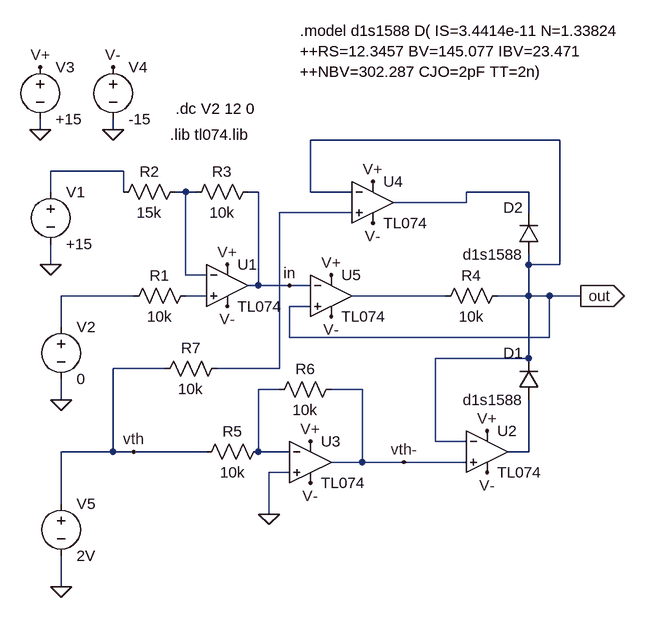
[diagram p0: schematic fig22down.asc]
fig22down.asc, the LTspice schematic file:
Version 4
SHEET 1 924 680
WIRE -80 -96 -80 -112
WIRE 32 -96 32 -112
WIRE 720 -80 336 -80
WIRE 48 -32 -64 -32
WIRE -64 0 -64 -32
WIRE 48 0 48 -32
WIRE 144 0 128 0
WIRE 160 0 144 0
WIRE 256 0 240 0
WIRE 336 0 336 -80
WIRE 400 0 336 0
WIRE 672 0 576 0
WIRE 576 16 576 0
WIRE 576 16 464 16
WIRE 400 32 288 32
WIRE 672 32 672 0
WIRE -64 112 -64 80
WIRE 672 112 672 96
WIRE 720 112 720 -80
WIRE 720 112 672 112
WIRE 144 128 144 0
WIRE 176 128 144 128
WIRE 256 144 256 0
WIRE 256 144 240 144
WIRE 304 144 256 144
WIRE 336 144 304 144
WIRE 64 160 -48 160
WIRE 176 160 144 160
WIRE 544 160 400 160
WIRE 672 160 672 112
WIRE 672 160 624 160
WIRE 704 160 672 160
WIRE 752 160 704 160
WIRE 336 176 304 176
WIRE -48 208 -48 160
WIRE 304 224 304 176
WIRE 704 224 704 160
WIRE 704 224 304 224
WIRE 672 256 672 160
WIRE 672 256 528 256
WIRE 112 272 32 272
WIRE 288 272 288 32
WIRE 288 272 192 272
WIRE 288 304 256 304
WIRE 416 304 368 304
WIRE -48 320 -48 288
WIRE 528 384 528 256
WIRE 576 384 528 384
WIRE 32 400 32 272
WIRE 32 400 -48 400
WIRE 64 400 32 400
WIRE 176 400 64 400
WIRE 256 400 256 304
WIRE 304 400 256 400
WIRE 672 400 672 320
WIRE 672 400 640 400
WIRE 416 416 416 304
WIRE 416 416 368 416
WIRE 480 416 416 416
WIRE 576 416 480 416
WIRE 304 432 272 432
WIRE -48 480 -48 400
WIRE 272 496 272 432
WIRE -48 608 -48 560
FLAG -64 112 0
FLAG -48 320 0
FLAG 272 496 0
FLAG 752 160 out
IOPIN 752 160 Out
FLAG -80 -96 0
FLAG 32 -96 0
FLAG -80 -192 V+
FLAG 32 -192 V-
FLAG 208 112 V+
FLAG 208 176 V-
FLAG 608 368 V+
FLAG 608 432 V-
FLAG -48 608 0
FLAG 304 144 in
FLAG 64 400 vth
FLAG 480 416 vth-
FLAG 336 384 V+
FLAG 368 128 V+
FLAG 432 -16 V+
FLAG 432 48 V-
FLAG 368 192 V-
FLAG 336 448 V-
SYMBOL Opamps\\opamp2 208 80 R0
SYMATTR InstName U1
SYMATTR Value TL074
SYMBOL res 48 176 R270
WINDOW 0 32 56 VTop 0
WINDOW 3 0 56 VBottom 0
SYMATTR InstName R1
SYMATTR Value 10k
SYMBOL res 32 16 R270
WINDOW 0 32 56 VTop 0
WINDOW 3 0 56 VBottom 0
SYMATTR InstName R2
SYMATTR Value 15k
SYMBOL res 144 16 R270
WINDOW 0 32 56 VTop 0
WINDOW 3 0 56 VBottom 0
SYMATTR InstName R3
SYMATTR Value 10k
SYMBOL res 528 176 R270
WINDOW 0 32 56 VTop 0
WINDOW 3 0 56 VBottom 0
SYMATTR InstName R4
SYMATTR Value 10k
SYMBOL voltage -64 -16 R0
WINDOW 123 0 0 Left 0
WINDOW 39 0 0 Left 0
SYMATTR InstName V1
SYMATTR Value +15
SYMBOL voltage -48 192 R0
WINDOW 123 0 0 Left 0
WINDOW 39 0 0 Left 0
SYMATTR InstName V2
SYMATTR Value 0
SYMBOL diode 688 320 R180
WINDOW 0 24 72 Left 0
WINDOW 3 24 0 Left 0
SYMATTR InstName D1
SYMATTR Value d1s1588
SYMBOL voltage -80 -208 R0
SYMATTR InstName V3
SYMATTR Value +15
SYMBOL voltage 32 -208 R0
SYMATTR InstName V4
SYMATTR Value -15
SYMBOL Opamps\\opamp2 608 336 R0
SYMATTR InstName U2
SYMATTR Value TL074
SYMBOL voltage -48 464 R0
WINDOW 123 0 0 Left 0
WINDOW 39 0 0 Left 0
SYMATTR InstName V5
SYMATTR Value 2V
SYMBOL Opamps\\opamp2 336 352 R0
SYMATTR InstName U3
SYMATTR Value TL074
SYMBOL Opamps\\opamp2 432 -48 R0
SYMATTR InstName U4
SYMATTR Value TL074
SYMBOL Opamps\\opamp2 368 96 R0
SYMATTR InstName U5
SYMATTR Value TL074
SYMBOL res 160 416 R270
WINDOW 0 32 56 VTop 0
WINDOW 3 0 56 VBottom 0
SYMATTR InstName R5
SYMATTR Value 10k
SYMBOL res 272 320 R270
WINDOW 0 32 56 VTop 0
WINDOW 3 0 56 VBottom 0
SYMATTR InstName R6
SYMATTR Value 10k
SYMBOL res 96 288 R270
WINDOW 0 32 56 VTop 0
WINDOW 3 0 56 VBottom 0
SYMATTR InstName R7
SYMATTR Value 10k
SYMBOL diode 688 96 R180
WINDOW 0 24 72 Left 0
WINDOW 3 24 0 Left 0
SYMATTR InstName D2
SYMATTR Value d1s1588
TEXT 128 -128 Left 0 !.dc V2 12 0
TEXT 120 -88 Left 0 !.lib tl074.lib
TEXT 320 -248 Left 0 !.model d1s1588 D( IS=3.4414e-11 N=1.33824 \n++RS=12.3457 BV=145.077 IBV=23.471 \n++NBV=302.287 CJO=2pF TT=2n)

The netlist it stands for:
* fig22down.asc
XU1 N006 N002 V+ V- in TL074  ; pins In+ In- V+ V- OUT
R1 N005 N006 10k
R2 N001 N002 15k
R3 N002 in 10k
R4 N007 out 10k
V1 N001 0 +15
V2 N005 0 0
D1 N009 out d1s1588
V3 V+ 0 +15
V4 V- 0 -15
XU2 vth- out V+ V- N009 TL074  ; pins In+ In- V+ V- OUT
V5 vth 0 2V
XU3 0 N008 V+ V- vth- TL074  ; pins In+ In- V+ V- OUT
XU4 N004 out V+ V- N003 TL074  ; pins In+ In- V+ V- OUT
XU5 out in V+ V- N007 TL074  ; pins In+ In- V+ V- OUT
R5 vth N008 10k
R6 N008 vth- 10k
R7 vth N004 10k
D2 out N003 d1s1588
.model D D
.lib standard.dio
.dc V2 12 0
.lib tl074.lib
.model d1s1588 D( IS=3.4414e-11 N=1.33824
++RS=12.3457 BV=145.077 IBV=23.471
++NBV=302.287 CJO=2pF TT=2n)
.backanno
.end